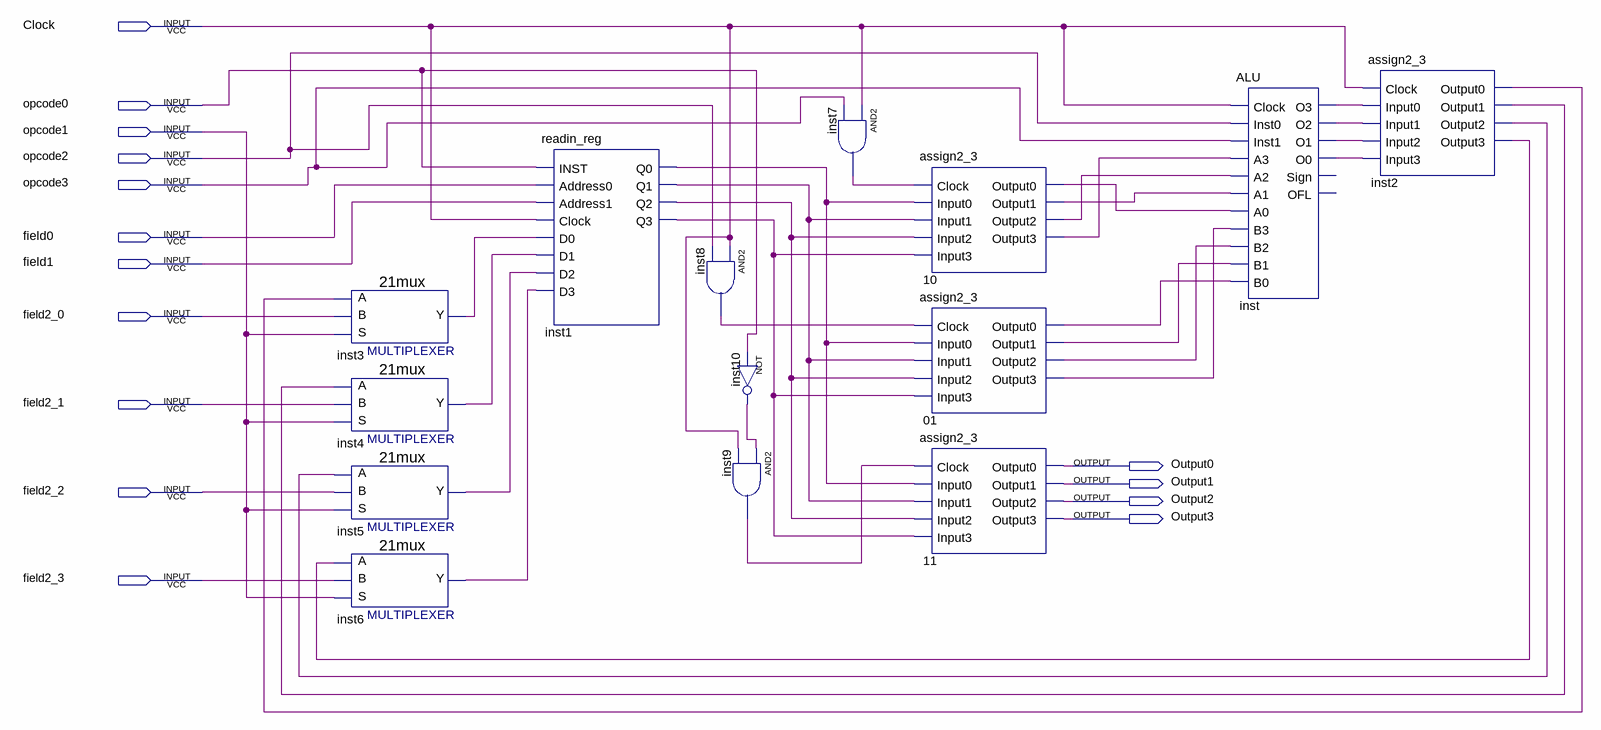
[diagram p0: schematic sheet]
// Quartus schematic system.bdf as structural Verilog: 14 symbols, 15 pins
module system (
  input  Clock,
  input  opcode0,
  input  opcode1,
  input  opcode2,
  input  opcode3,
  input  field0,
  input  field1,
  input  field2_0,
  input  field2_1,
  input  field2_2,
  input  field2_3,
  output Output0,
  output Output1,
  output Output2,
  output Output3
);

  wire inst1_q0, inst1_q1, inst1_q2, inst1_q3, inst2_output0, inst2_output1, inst2_output2, inst2_output3,
       inst3_y, inst4_y, inst5_y, inst6_y, inst7_out, inst8_out, inst9_out, inst10_out, inst_o0, inst_o1,
       inst_o2, inst_o3, n01_output0, n01_output1, n01_output2, n01_output3, n10_output0, n10_output1,
       n10_output2, n10_output3;

  \21mux  inst3 (.S(opcode1), .B(field2_0), .A(inst2_output0), .Y(inst3_y));
  \21mux  inst4 (.S(opcode1), .B(field2_1), .A(inst2_output1), .Y(inst4_y));
  \21mux  inst5 (.S(opcode1), .B(field2_2), .A(inst2_output2), .Y(inst5_y));
  \21mux  inst6 (.S(opcode1), .B(field2_3), .A(inst2_output3), .Y(inst6_y));
  readin_reg inst1 (
    .INST(opcode0), .Address0(field0), .Address1(field1), .Clock(Clock), .D0(inst3_y), .D1(inst4_y),
    .D2(inst5_y), .D3(inst6_y), .Q0(inst1_q0), .Q1(inst1_q1), .Q2(inst1_q2), .Q3(inst1_q3));
  and inst8 (inst8_out, Clock, opcode2);
  not inst10 (inst10_out, opcode0);
  and inst9 (inst9_out, inst10_out, Clock);
  and inst7 (inst7_out, Clock, opcode3);
  assign2_3 u_10 (
    .Clock(inst7_out), .Input0(inst1_q0), .Input1(inst1_q1), .Input2(inst1_q2), .Input3(inst1_q3),
    .Output0(n10_output0), .Output1(n10_output1), .Output2(n10_output2), .Output3(n10_output3));
  assign2_3 u_01 (
    .Clock(inst8_out), .Input0(inst1_q0), .Input1(inst1_q1), .Input2(inst1_q2), .Input3(inst1_q3),
    .Output0(n01_output0), .Output1(n01_output1), .Output2(n01_output2), .Output3(n01_output3));
  assign2_3 u_11 (
    .Clock(inst9_out), .Input0(inst1_q0), .Input1(inst1_q1), .Input2(inst1_q2), .Input3(inst1_q3),
    .Output0(Output0), .Output1(Output1), .Output2(Output2), .Output3(Output3));
  ALU inst (
    .Clock(Clock), .Inst0(opcode2), .Inst1(opcode3), .A3(n10_output3), .A2(n10_output2), .A1(n10_output1),
    .A0(n10_output0), .B3(n01_output3), .B2(n01_output2), .B1(n01_output1), .B0(n01_output0), .O3(inst_o3),
    .O2(inst_o2), .O1(inst_o1), .O0(inst_o0));  // open: Sign, OFL
  assign2_3 inst2 (
    .Clock(Clock), .Input0(inst_o3), .Input1(inst_o2), .Input2(inst_o1), .Input3(inst_o0),
    .Output0(inst2_output0), .Output1(inst2_output1), .Output2(inst2_output2), .Output3(inst2_output3));
endmodule
